# Altium schematic sheet Tp_Integrador.SchDoc
size A; SheetNumber: 1; SheetTotal: 2
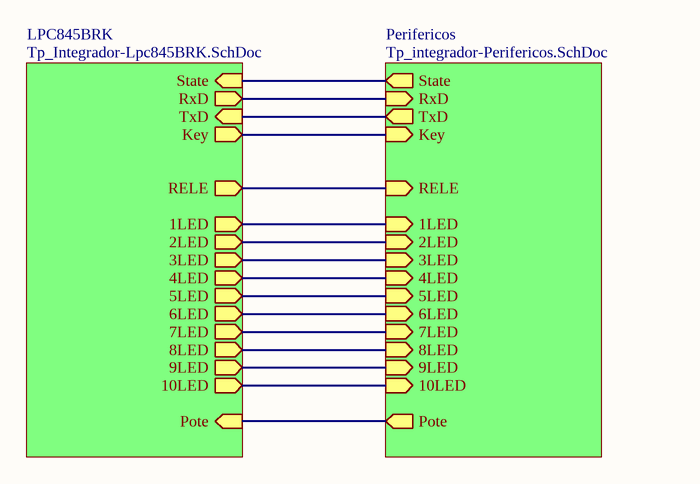
[diagram p0: Tp_Integrador.SchDoc]

## Sub-sheets
LPC845BRK = Tp_Integrador-Lpc845BRK.SchDoc: State (in), RxD (out), TxD (in), Key (out), RELE (out), 1LED (out), 2LED (out), 3LED (out), 4LED (out), 5LED (out), 6LED (out), 7LED (out), 8LED (out), 9LED (out), 10LED (out), Pote (in)
Perifericos = Tp_integrador-Perifericos.SchDoc: RELE (in), State (out), RxD (in), TxD (out), Key (in), 1LED (in), 2LED (in), 4LED (in), 3LED (in), 5LED (in), 6LED (in), 7LED (in), 8LED (in), 9LED (in), 10LED (in), Pote (out)

## Nets
(unnamed): sheet Perifericos/RELE, sheet LPC845BRK/RELE
(unnamed): sheet Perifericos/State, sheet LPC845BRK/State
(unnamed): sheet Perifericos/RxD, sheet LPC845BRK/RxD
(unnamed): sheet Perifericos/TxD, sheet LPC845BRK/TxD
(unnamed): sheet Perifericos/Key, sheet LPC845BRK/Key
(unnamed): sheet Perifericos/1LED, sheet LPC845BRK/1LED
(unnamed): sheet Perifericos/2LED, sheet LPC845BRK/2LED
(unnamed): sheet Perifericos/4LED, sheet LPC845BRK/4LED
(unnamed): sheet Perifericos/3LED, sheet LPC845BRK/3LED
(unnamed): sheet Perifericos/5LED, sheet LPC845BRK/5LED
(unnamed): sheet Perifericos/6LED, sheet LPC845BRK/6LED
(unnamed): sheet Perifericos/7LED, sheet LPC845BRK/7LED
(unnamed): sheet Perifericos/8LED, sheet LPC845BRK/8LED
(unnamed): sheet Perifericos/9LED, sheet LPC845BRK/9LED
(unnamed): sheet Perifericos/10LED, sheet LPC845BRK/10LED
(unnamed): sheet Perifericos/Pote, sheet LPC845BRK/Pote